# Altium schematic sheet MCU.SchDoc: MCU
size A3; DocumentNumber: MB1144; Revision: C-02; SheetNumber: 3; SheetTotal: 25; PageSetup: Record=PageOptions|CenterHorizontal=True|CenterVertical=True|PrintScale=1.04|XCorrection=1.00|YCorrection=1.00|PrintKind=1|BorderSize=5000000|LeftOffset=0|BottomOffset=0|Orientation=2|PaperLength=1000|PaperWidth=1000|Scale=100|PaperSource=7|PrintQuality=600|MediaType=1|DitherType=10|PaperKind=A3|PrintScaleMode=1; Project: STM32L476G-EVAL; ModifiedDate: 9/23/2015
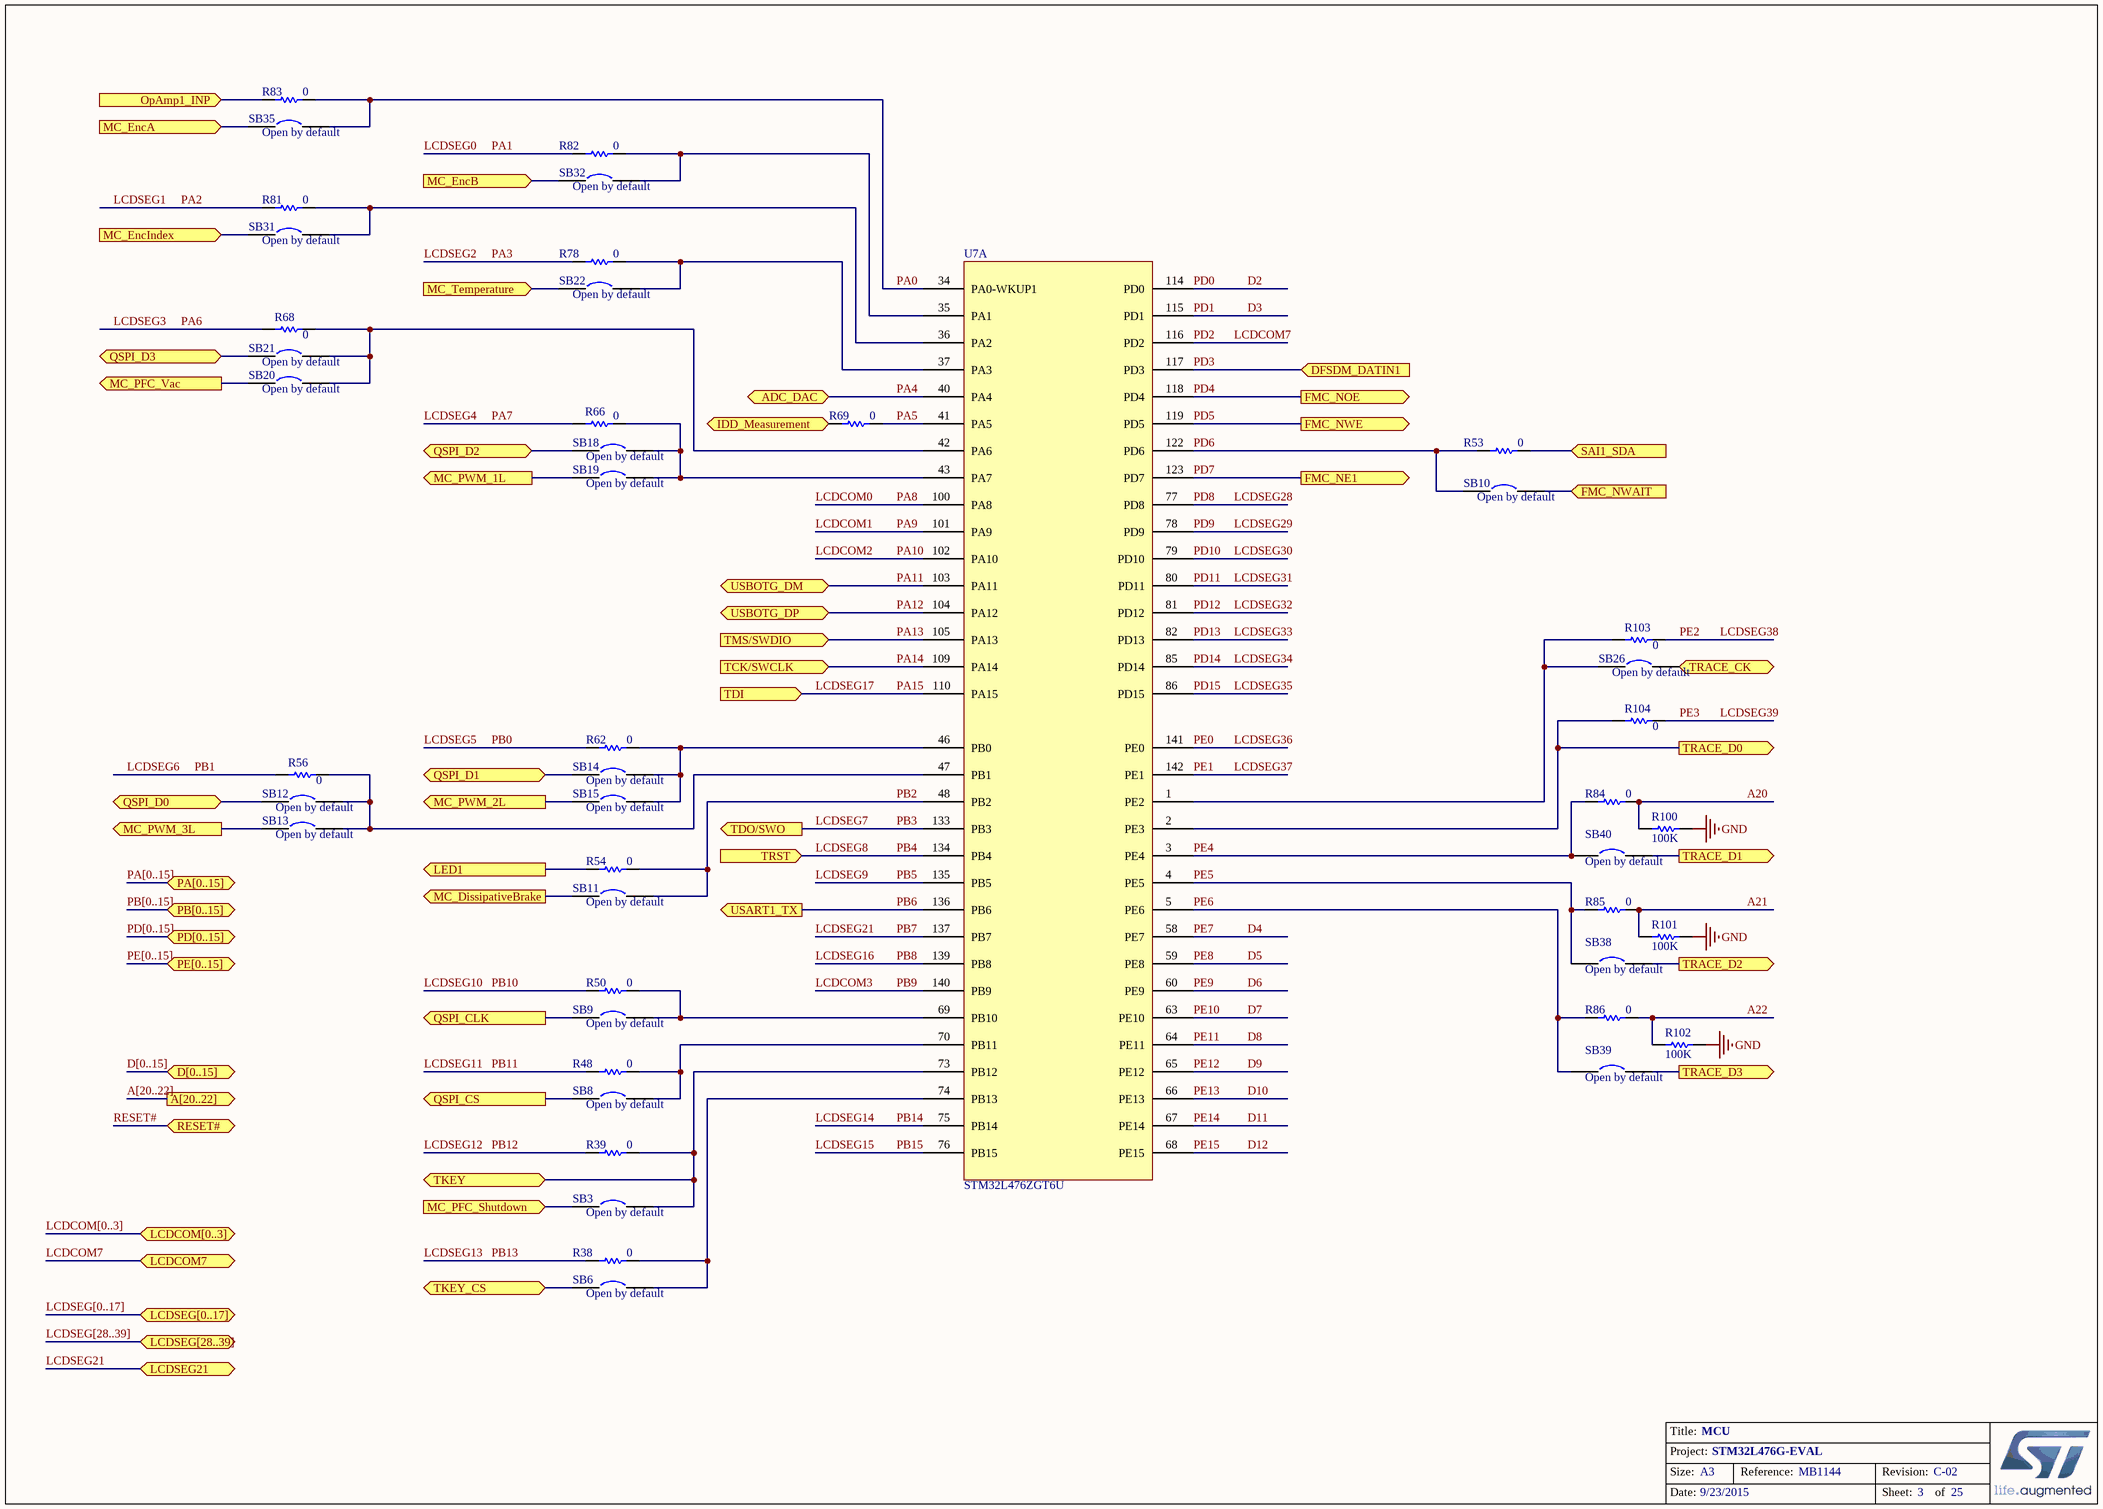
[diagram p0: MCU.SchDoc]

## Parts
R38  0  [SB_0603]
R39  0  [SB_0603]
R48  0  [SB_0603]
R50  0  [SB_0603]
R53  0  [SB_0603]
R54  0  [SB_0603]
R56  0  [SB_0603]
R62  0  [SB_0603]
R66  0  [SB_0603]
R68  0  [SB_0603]
R69  0  [0603R]
R78  0  [SB_0603]
R81  0  [SB_0603]
R82  0  [SB_0603]
R83  0  [SB_0603]
R84  0  [SB_0603]
R85  0  [SB_0603]
R86  0  [SB_0603]
R100  100K  [0402R]
R101  100K  [0402R]
R102  100K  [0402R]
R103  0  [SB_0603]
R104  0  [SB_0603]
SB3  Open by default  [SB_0603]
SB6  Open by default  [SB_0603]
SB8  Open by default  [SB_0603]
SB9  Open by default  [SB_0603]
SB10  Open by default  [SB_0603]
SB11  Open by default  [SB_0603]
SB12  Open by default  [SB_0603]
SB13  Open by default  [SB_0603]
SB14  Open by default  [SB_0603]
SB15  Open by default  [SB_0603]
SB18  Open by default  [SB_0603]
SB19  Open by default  [SB_0603]
SB20  Open by default  [SB_0603]
SB21  Open by default  [SB_0603]
SB22  Open by default  [SB_0603]
SB26  Open by default  [SB_0603]
SB31  Open by default  [SB_0603]
SB32  Open by default  [SB_0603]
SB35  Open by default  [SB_0603]
SB38  Open by default  [SB_0603]
SB39  Open by default  [SB_0603]
SB40  Open by default  [SB_0603]
U7  STM32L476ZGT6U  [TQFP144_0R5_22X22_SOCKET]  (part A of 3)

## Ports
A[20..22] (out), ADC_DAC (bidir), D[0..15] (bidir), DFSDM_DATIN1 (in), FMC_NE1 (out), FMC_NOE (out), FMC_NWAIT (in), FMC_NWE (out), IDD_Measurement (in), LCDCOM7, LCDCOM[0..3] (bidir), LCDSEG21 (bidir), LCDSEG[0..17] (bidir), LCDSEG[28..39] (bidir), LED1 (out), MC_DissipativeBrake (out), MC_EncA (in), MC_EncB (in), MC_EncIndex (in), MC_PFC_Shutdown (in), MC_PFC_Vac (out), MC_PWM_1L (out), MC_PWM_2L (out), MC_PWM_3L (out), MC_Temperature (in), OpAmp1_INP (in), PA[0..15] (bidir), PB[0..15] (bidir), PD[0..15] (bidir), PE[0..15] (bidir), QSPI_CLK (out), QSPI_CS (out), QSPI_D0 (bidir), QSPI_D1 (bidir), QSPI_D2 (bidir), QSPI_D3 (bidir), RESET# (bidir), SAI1_SDA (in), TCK/SWCLK (in), TDI (in), TDO/SWO (out), TKEY, TKEY_CS, TMS/SWDIO (in), TRACE_CK (out), TRACE_D0 (out), TRACE_D1 (out), TRACE_D2 (out), TRACE_D3 (out), TRST (in), USART1_TX (out), USBOTG_DM (bidir), USBOTG_DP (bidir)

## Nets
GND: R100.2 R101.2 R102.2
A20: R84.1 R100.1
A21: R85.1 R101.1
A22: R86.1 R102.1
D2: U7.114(PD0)  [also labelled PD0]
D3: U7.115(PD1)  [also labelled PD1]
D4: U7.58(PE7)  [also labelled PE7]
D5: U7.59(PE8)  [also labelled PE8]
D6: U7.60(PE9)  [also labelled PE9]
D7: U7.63(PE10)  [also labelled PE10]
D8: U7.64(PE11)  [also labelled PE11]
D9: U7.65(PE12)  [also labelled PE12]
D10: U7.66(PE13)  [also labelled PE13]
D11: U7.67(PE14)  [also labelled PE14]
D12: U7.68(PE15)  [also labelled PE15]
FMC_NWAIT: SB10.2 ; port FMC_NWAIT
IDD_Measurement: R69.2 ; port IDD_Measurement
LCDCOM0: U7.100(PA8)  [also labelled PA8]
LCDCOM1: U7.101(PA9)  [also labelled PA9]
LCDCOM2: U7.102(PA10)  [also labelled PA10]
LCDCOM3: U7.140(PB9)  [also labelled PB9]
LCDCOM7: U7.116(PD2) ; port LCDCOM7  [also labelled PD2]
LCDSEG0: R82.1  [also labelled PA1]
LCDSEG1: R81.1  [also labelled PA2]
LCDSEG2: R78.2  [also labelled PA3]
LCDSEG3: R68.1  [also labelled PA6]
LCDSEG4: R66.1  [also labelled PA7]
LCDSEG5: R62.1  [also labelled PB0]
LCDSEG6: R56.1  [also labelled PB1]
LCDSEG7: U7.133(PB3) ; port TDO/SWO  [also labelled PB3]
LCDSEG8: U7.134(PB4) ; port TRST  [also labelled PB4]
LCDSEG9: U7.135(PB5)  [also labelled PB5]
LCDSEG10: R50.1  [also labelled PB10]
LCDSEG11: R48.1  [also labelled PB11]
LCDSEG12: R39.2  [also labelled PB12]
LCDSEG13: R38.1  [also labelled PB13]
LCDSEG14: U7.75(PB14)  [also labelled PB14]
LCDSEG15: U7.76(PB15)  [also labelled PB15]
LCDSEG16: U7.139(PB8)  [also labelled PB8]
LCDSEG17: U7.110(PA15) ; port TDI  [also labelled PA15]
LCDSEG21: U7.137(PB7) ; port LCDSEG21  [also labelled PB7]
LCDSEG28: U7.77(PD8)  [also labelled PD8]
LCDSEG29: U7.78(PD9)  [also labelled PD9]
LCDSEG30: U7.79(PD10)  [also labelled PD10]
LCDSEG31: U7.80(PD11)  [also labelled PD11]
LCDSEG32: U7.81(PD12)  [also labelled PD12]
LCDSEG33: U7.82(PD13)  [also labelled PD13]
LCDSEG34: U7.85(PD14)  [also labelled PD14]
LCDSEG35: U7.86(PD15)  [also labelled PD15]
LCDSEG36: U7.141(PE0)  [also labelled PE0]
LCDSEG37: U7.142(PE1)  [also labelled PE1]
LCDSEG38: R103.2  [also labelled PE2]
LCDSEG39: R104.2  [also labelled PE3]
LED1: R54.2 ; port LED1
MC_DissipativeBrake: SB11.1 ; port MC_DissipativeBrake
MC_EncA: SB35.1 ; port MC_EncA
MC_EncB: SB32.1 ; port MC_EncB
MC_EncIndex: SB31.1 ; port MC_EncIndex
MC_PFC_Shutdown: SB3.1 ; port MC_PFC_Shutdown
MC_PFC_Vac: SB20.1 ; port MC_PFC_Vac
MC_PWM_1L: SB19.1 ; port MC_PWM_1L
MC_PWM_2L: SB15.1 ; port MC_PWM_2L
MC_PWM_3L: SB13.1 ; port MC_PWM_3L
MC_Temperature: SB22.1 ; port MC_Temperature
OpAmp1_INP: R83.2 ; port OpAmp1_INP
PA0: R83.1 SB35.2 U7.34(PA0-WKUP1)
PA4: U7.40(PA4) ; port ADC_DAC
PA5: R69.1 U7.41(PA5)
PA11: U7.103(PA11) ; port USBOTG_DM
PA12: U7.104(PA12) ; port USBOTG_DP
PA13: U7.105(PA13) ; port TMS/SWDIO
PA14: U7.109(PA14) ; port TCK/SWCLK
PB2: R54.1 SB11.2 U7.48(PB2)
PB6: U7.136(PB6) ; port USART1_TX
PD3: U7.117(PD3) ; port DFSDM_DATIN1
PD4: U7.118(PD4) ; port FMC_NOE
PD5: U7.119(PD5) ; port FMC_NWE
PD6: R53.1 SB10.1 U7.122(PD6)
PD7: U7.123(PD7) ; port FMC_NE1
PE4: R84.2 SB40.1 U7.3(PE4)
PE5: R85.2 SB38.1 U7.4(PE5)
PE6: R86.2 SB39.1 U7.5(PE6)
QSPI_CLK: SB9.1 ; port QSPI_CLK
QSPI_CS: SB8.1 ; port QSPI_CS
QSPI_D0: SB12.1 ; port QSPI_D0
QSPI_D1: SB14.1 ; port QSPI_D1
QSPI_D2: SB18.1 ; port QSPI_D2
QSPI_D3: SB21.1 ; port QSPI_D3
RESET#: port RESET#
SAI1_SDA: R53.2 ; port SAI1_SDA
TKEY: R39.1 SB3.2 U7.73(PB12) ; port TKEY
TKEY_CS: SB6.1 ; port TKEY_CS
TRACE_CK: SB26.2 ; port TRACE_CK
TRACE_D0: R104.1 U7.2(PE3) ; port TRACE_D0
TRACE_D1: SB40.2 ; port TRACE_D1
TRACE_D2: SB38.2 ; port TRACE_D2
TRACE_D3: SB39.2 ; port TRACE_D3
NetR38_2: R38.2 SB6.2 U7.74(PB13)
NetR48_2: R48.2 SB8.2 U7.70(PB11)
NetR50_2: R50.2 SB9.2 U7.69(PB10)
NetR56_2: R56.2 SB12.2 SB13.2 U7.47(PB1)
NetR62_2: R62.2 SB14.2 SB15.2 U7.46(PB0)
NetR66_2: R66.2 SB18.2 SB19.2 U7.43(PA7)
NetR68_2: R68.2 SB20.2 SB21.2 U7.42(PA6)
NetR78_1: R78.1 SB22.2 U7.37(PA3)
NetR81_2: R81.2 SB31.2 U7.36(PA2)
NetR82_2: R82.2 SB32.2 U7.35(PA1)
NetR103_1: R103.1 SB26.1 U7.1(PE2)

## Buses and harness runs
bus A[20..22] = port A[20..22]
bus D[0..15] = port D[0..15]
bus LCDCOM[0..3] = port LCDCOM[0..3]
bus LCDSEG[0..17] = port LCDSEG[0..17]
bus LCDSEG[28..39] = port LCDSEG[28..39]
bus PA[0..15] = port PA[0..15]
bus PB[0..15] = port PB[0..15]
bus PD[0..15] = port PD[0..15]
bus PE[0..15] = port PE[0..15]

## Notes on the sheet
- Title:
- Project:
- Size:
- Date:
- A3
- Reference:
- Sheet:
- Revision:
- of

## Library data of the parts
R38 R48 R50 R53 R56 R62 R66 R68 R81 R82 R103 R104 = Res1: Resistor; Value: 1K; Ordered by: Subcon; ECCN_US/EU: NA; Published: 8-Jun-2000; Revision: July-2002: Re-released for DXP Platform.; Publisher: Altium Limited
R39 R54 R69 R78 R83-R86 R100-R102 = res1: Resistor; Value: 1K; Ordered by: Subcon; ECCN_US/EU: NA; Published: 8-Jun-2000; Revision: July-2002: Re-released for DXP Platform.; Publisher: Altium Limited
SB3 SB6 SB8-SB15 SB18-SB22 SB26 SB31 SB32 SB35 SB38-SB40 = Circuit Breaker: Ordered by: Subcon; Comments: Solder bridge; Fitted: NO; ECCN_US/EU: NA; Published: 24-Mar-1999; Revision: July-2002: Re-released for DXP Platform.; Publisher: Altium Limited
U7 = STM32L476_TQFP144: Manuf_Part_1: STM32L476ZGT6U cut1.3; Ordered by: ST; ECCN_US/EU: 3A991A2/NEC; Assembly: MCU; Ref St: 9175195; Manuf_1: ST